# Altium schematic sheet Sound_Pops.SchDoc
size A4; SheetNumber: 1; SheetTotal: 6; DrawingNumber: SCH-001; SheetSize: A4
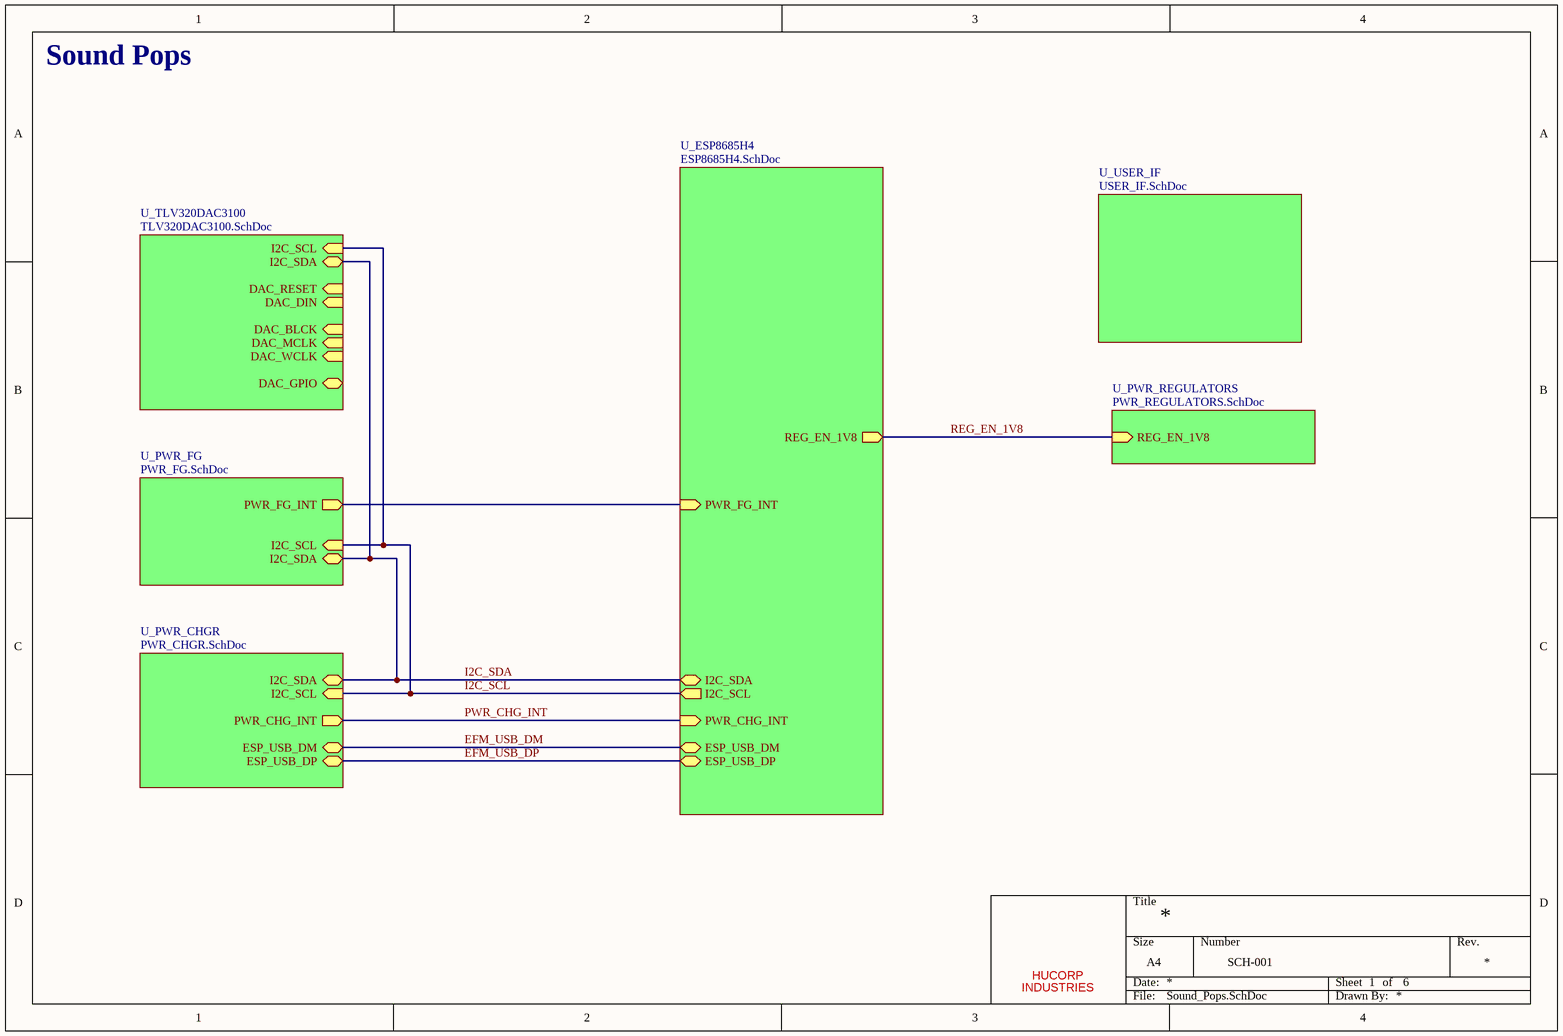
[diagram p0: Sound_Pops.SchDoc]

## Parts
*  HUCORP  (value not drawn)  (graphical)

## Sub-sheets
U_ESP8685H4 = ESP8685H4.SchDoc: ESP_USB_DM (bidir), ESP_USB_DP (bidir), I2C_SCL (out), I2C_SDA (bidir), PWR_CHG_INT (in), REG_EN_1V8 (out), PWR_FG_INT (in)
U_PWR_CHGR = PWR_CHGR.SchDoc: ESP_USB_DP (bidir), I2C_SCL (in), I2C_SDA (bidir), ESP_USB_DM (bidir), PWR_CHG_INT (out)
U_PWR_FG = PWR_FG.SchDoc: I2C_SDA (bidir), I2C_SCL (in), PWR_FG_INT (out)
U_PWR_REGULATORS = PWR_REGULATORS.SchDoc: REG_EN_1V8 (in)
U_TLV320DAC3100 = TLV320DAC3100.SchDoc: I2C_SDA (bidir), I2C_SCL (in), DAC_RESET (in), DAC_BLCK (in), DAC_DIN (in), DAC_MCLK (in), DAC_WCLK (in), DAC_GPIO (bidir)
U_USER_IF = USER_IF.SchDoc: no entries

## Nets
EFM_USB_DM: sheet U_ESP8685H4/ESP_USB_DM, sheet U_PWR_CHGR/ESP_USB_DM
EFM_USB_DP: sheet U_ESP8685H4/ESP_USB_DP, sheet U_PWR_CHGR/ESP_USB_DP
I2C_SCL: sheet U_ESP8685H4/I2C_SCL, sheet U_TLV320DAC3100/I2C_SCL, sheet U_PWR_FG/I2C_SCL, sheet U_PWR_CHGR/I2C_SCL
I2C_SDA: sheet U_ESP8685H4/I2C_SDA, sheet U_TLV320DAC3100/I2C_SDA, sheet U_PWR_FG/I2C_SDA, sheet U_PWR_CHGR/I2C_SDA
PWR_CHG_INT: sheet U_ESP8685H4/PWR_CHG_INT, sheet U_PWR_CHGR/PWR_CHG_INT
REG_EN_1V8: sheet U_ESP8685H4/REG_EN_1V8, sheet U_PWR_REGULATORS/REG_EN_1V8
(unnamed): sheet U_ESP8685H4/PWR_FG_INT, sheet U_PWR_FG/PWR_FG_INT

## Notes on the sheet
- Sound Pops
- (in symbol TitleBlock1) Title; Size; Number; Rev.; INDUSTRIES; Date:; Sheet; of; File:; Drawn By:

## Library data of the parts
* = TitleBlock1: HUCORP Title Block